# EAGLE design Timelapse (EAGLE 7.2.0)
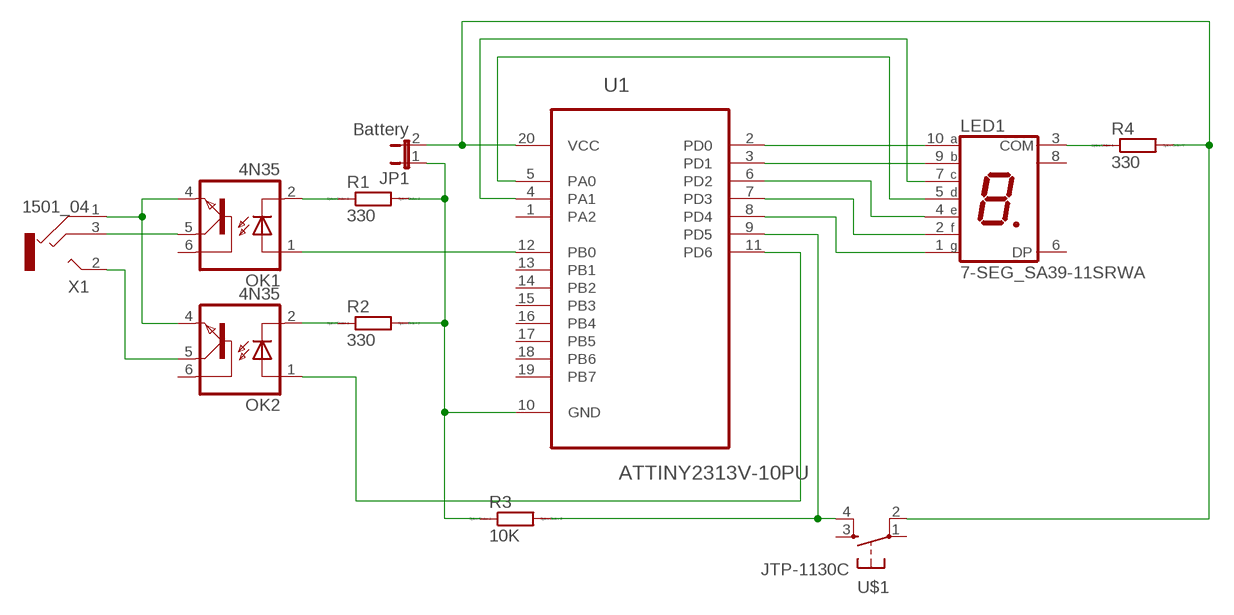
[diagram p0: schematic, sheet 1]

## Parts
JP1  Battery  JP1E  [JP1]
LED1  7-SEG_SA39-11SRWA  [SA39-11SRWA]
OK1  4N35  [DIL06]
OK2  4N35  [DIL06]
R1  330  R0204/7  [0204/7]
R2  330  R0204/7  [0204/7]
R3  10K  R0204/7  [0204/7]
R4  330  R0204/7  [0204/7]
U1  ATTINY2313V-10PU  [DIP254P762X533-20]
U$1  JTP-1130C  [JTP-1130]
X1  1501_04  [1501_05]

## Nets
N$1: LED1.10(A) U1.2(PD0)
N$2: LED1.9(B) U1.3(PD1)
N$3: LED1.4(E) U1.6(PD2)
N$4: LED1.2(F) U1.7(PD3)
N$5: LED1.1(G) U1.8(PD4)
N$6: LED1.7(C) U1.4(PA1)
N$7: LED1.5(D) U1.5(PA0)
N$8: LED1.3(COM) R4.1
N$9: JP1.2 R4.2 U1.20(VCC) U$1.2(P1)
N$10: R3.2 U1.9(PD5) U$1.4(S1)
N$11: JP1.1 R1.2 R2.2 R3.1 U1.10(GND)
N$12: OK2.1(A) U1.11(PD6)
N$13: OK2.2(C) R2.1
N$14: OK1.2(C) R1.1
N$15: OK1.1(A) U1.12(PB0)
N$16: OK1.4(EMI) OK2.4(EMI) X1.1
N$18: OK1.5(COL) X1.3
N$19: OK2.5(COL) X1.2
Unconnected: LED1.6(DP) LED1.8(COM) OK1.6(BAS) OK2.6(BAS) U1.1(PA2) U1.13(PB1) U1.14(PB2) U1.15(PB3) U1.16(PB4) U1.17(PB5) U1.18(PB6) U1.19(PB7) U$1.1(P) U$1.3(S)

## Library data of the parts
JP1 = jumper:JP1E: JUMPER
LED1 = display-kingbright:7-SEG_: Kingbright 14.2mm (0.56 INCH) SINGLE DIGIT NUMERIC DUISPLAY Source: SA56-11EWA(Ver1189471036.pdf; OC_FARNELL: unknown; OC_NEWARK: unknown
OK1 OK2 = optocoupler:4N35: MOTOROLA OPTO COUPLER; MF: FAIRCHILD SEMICONDUCTOR; MPN: 4N35; OC_FARNELL: 1328375; OC_NEWARK: 72K9946
R1-R4 = eagle-ltspice:R: RESISTOR, European symbol; SPICEMODEL: NONE; SPICEPREFIX: R
U1 = Atmel_By_element14_Batch_1-00:ATTINY2313V-10PU: Microcontroller; MPN: ATTINY2313V-10PU; OC_FARNELL: 9171614; OC_NEWARK: 01M6916; PACKAGE: DIP-20; SUPPLIER: ATMEL
U$1 = n39:JTP-1130: Kurzhubtaster 6x6mm, Höhe: 8,0mm, 12V, vertikal TASTER 9305 <http://www.reichelt.de/?ARTICLE=44586>; REICHELT: TASTER 9305
X1 = con-lumberg:1501_0*: Jack connectors according to JISC 6560, 2.5 mm Klinkensteckverbinder nach JISC 6560, 2,5 mm Source: http://www.lumberg.com/Produkte/PDFs/1501_05.pdfedit 1501_03 http://www.lumberg.com/Produkte/PDFs/1501_06.pdf; OC_FARNELL: 1216977; OC_NEWARK: unknown

## Board
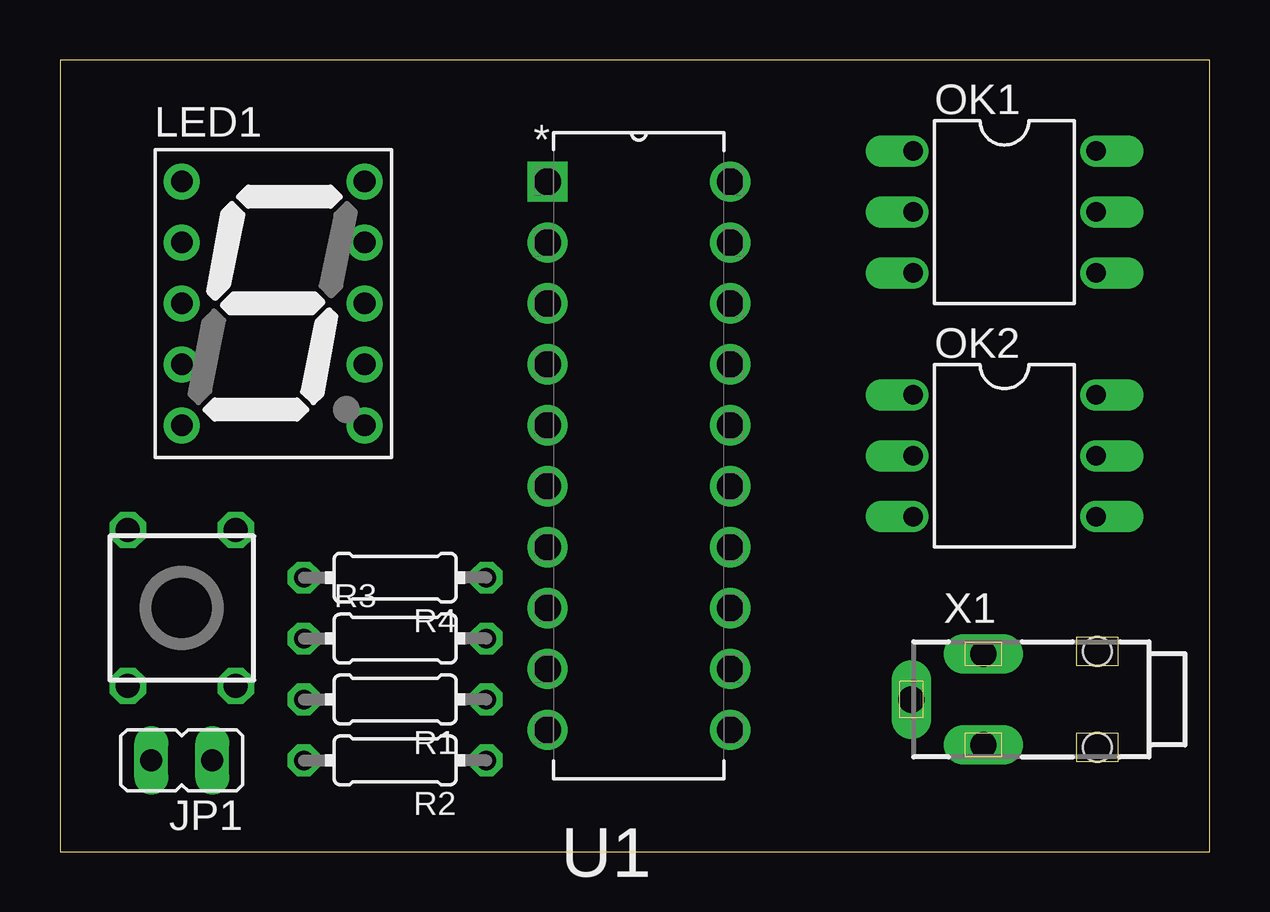
[diagram p1: board, top side]
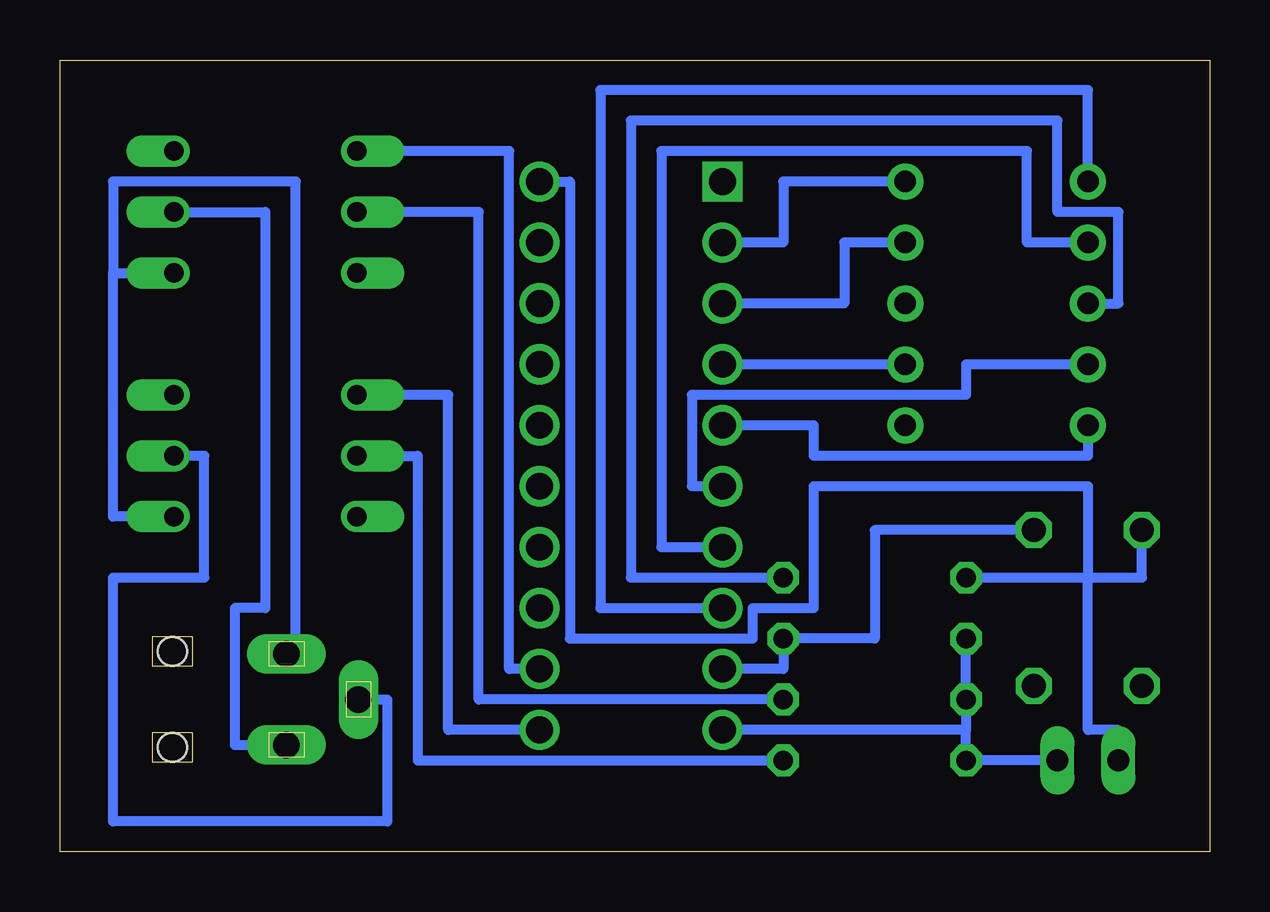
[diagram p2: board, bottom side, seen from below]

Size 47.93 x 33.01 mm. Coordinates in mm from the lower left corner, seen from the top.
Outline: 0,0 47.93,0 47.93,33.01 0,33.01 0,0
Copper layers (1*16): Top 0.035mm / dielectric 1.5mm / Bottom 0.035mm
Design rules "default": minimum track width 10mil, minimum drill 24mil, track to track 8mil, track to pad 8mil, pad to pad 8mil, via to via 8mil, smd to smd 8mil, copper to edge 40mil, drill to drill 8mil, minimum pad ring 10mil, minimum via ring 8mil, stop-mask expansion 4mil, vias tented up to drill 0mil, thermal gap 10mil

### Footprints (pad centres in the part's own frame; a part is rotated, then mirrored left to right if it is on the bottom)
JP1 = drill 0.914 long: 1 0,-1.27; 2 0,1.27
SA39-11SRWA = drill 0.9 pad 1.5: 1 -3.81,5.08; 2 -3.81,2.54; 3 -3.81,0; 4 -3.81,-2.54; 5 -3.81,-5.08; 6 3.81,-5.08; 7 3.81,-2.54; 8 3.81,0; 9 3.81,2.54; 10 3.81,5.08
DIL06 = drill 0.813 offset: 1 -2.54,-3.81; 2 0,-3.81; 3 2.54,-3.81; 4 2.54,3.81; 5 0,3.81; 6 -2.54,3.81
0204/7 = drill 0.813 octagon: 1 -3.81,0; 2 3.81,0
DIP254P762X533-20 = drill 1.118 square: 1 -7.62,22.86 | drill 1.118: 2 -7.62,20.32; 3 -7.62,17.78; 4 -7.62,15.24; 5 -7.62,12.7; 6 -7.62,10.16; 7 -7.62,7.62; 8 -7.62,5.08; 9 -7.62,2.54; 10 -7.62,0; 11 0,0; 12 0,2.54; 13 0,5.08; 14 0,7.62; 15 0,10.16; 16 0,12.7; 17 0,15.24; 18 0,17.78; 19 0,20.32; 20 0,22.86
JTP-1130 = drill 1 octagon: 1 3.25,-2.25; 2 -3.25,-2.25; 3 3.25,2.25; 4 -3.25,2.25
1501_05 = drill 1.1 pad 1.4 long: 1 -1.9,-8.5; 2 0,-11.5; 3 1.9,-8.5 | hole 1.2: -2,-3.75; 2,-3.75

### Placement (x,y rotation side)
JP1  5.08,3.81 90 top
LED1  8.89,22.86 0 top
OK1  39.37,26.67 270 top
OK2  39.37,16.51 270 top
R1  13.97,6.35 180 top
R2  13.97,3.81 180 top
R3  13.97,8.89 0 top
R4  13.97,11.43 180 top
U1  27.94,5.08 0 top
U$1  5.08,10.16 270 top
X1  46.99,6.35 270 top

### Tracks (layer width: path | path; a pad name or v marks a point on that pad's centre or on a via)
N$1
  Bottom 0.406: LED1.10 17.78,27.94 17.78,25.4 U1.2
N$2
  Bottom 0.406: LED1.9 15.24,25.4 15.24,22.86 U1.3
N$3
  Bottom 0.406: LED1.4 10.16,20.32 10.16,19.05 21.59,19.05 21.59,15.24 U1.6
N$4
  Bottom 0.406: LED1.2 7.62,25.4 7.62,29.21 22.86,29.21 22.86,12.7 U1.7
N$5
  Bottom 0.406: LED1.1 5.08,31.75 25.4,31.75 25.4,10.16 U1.8
N$6
  Bottom 0.406: LED1.7 U1.4
N$7
  Bottom 0.406: LED1.5 5.08,16.51 16.51,16.51 16.51,17.78 U1.5
N$8
  Bottom 0.406: LED1.3 3.81,22.86 3.81,26.67 6.35,26.67 6.35,30.48 24.13,30.48 24.13,11.43 R4.1
N$9
  Bottom 0.406: R4.2 5.08,11.43 | 5.08,11.43 2.83,11.43 U$1.2 | U1.20 26.67,27.94 26.67,8.89 19.05,8.89 19.05,10.16 16.51,10.16 16.51,15.24 5.08,15.24 5.08,12.7 5.08,11.43 | JP1.2 3.81,5.08 5.08,5.08 5.08,11.43
N$10
  Bottom 0.406: U1.9 17.78,7.62 R3.2 13.97,8.89 13.97,13.41 U$1.4
N$11
  Bottom 0.406: JP1.1 R2.2 10.16,5.08 | R3.1 R1.2 10.16,5.08 | 10.16,5.08 U1.10
N$12
  Bottom 0.406: U1.11 31.75,5.08 31.75,19.05 OK2.1
N$13
  Bottom 0.406: OK2.2 33.02,16.51 33.02,3.81 R2.1
N$14
  Bottom 0.406: R1.1 30.48,6.35 30.48,26.67 OK1.2
N$15
  Bottom 0.406: U1.12 29.21,7.62 29.21,29.21 OK1.1
N$16
  Bottom 0.406: X1.1 38.1,8.25 38.1,27.94 45.72,27.94 45.72,24.13 | 45.72,24.13 OK1.4 | OK2.4 45.72,13.97 45.72,24.13
N$18
  Bottom 0.406: OK1.5 39.37,26.67 39.37,10.16 40.64,10.16 40.64,4.45 X1.3
N$19
  Bottom 0.406: X1.2 34.29,6.35 34.29,1.27 45.72,1.27 45.72,11.43 41.91,11.43 41.91,16.51 OK2.5